# EAGLE design cociclo_03_01 (EAGLE 8.6.0)
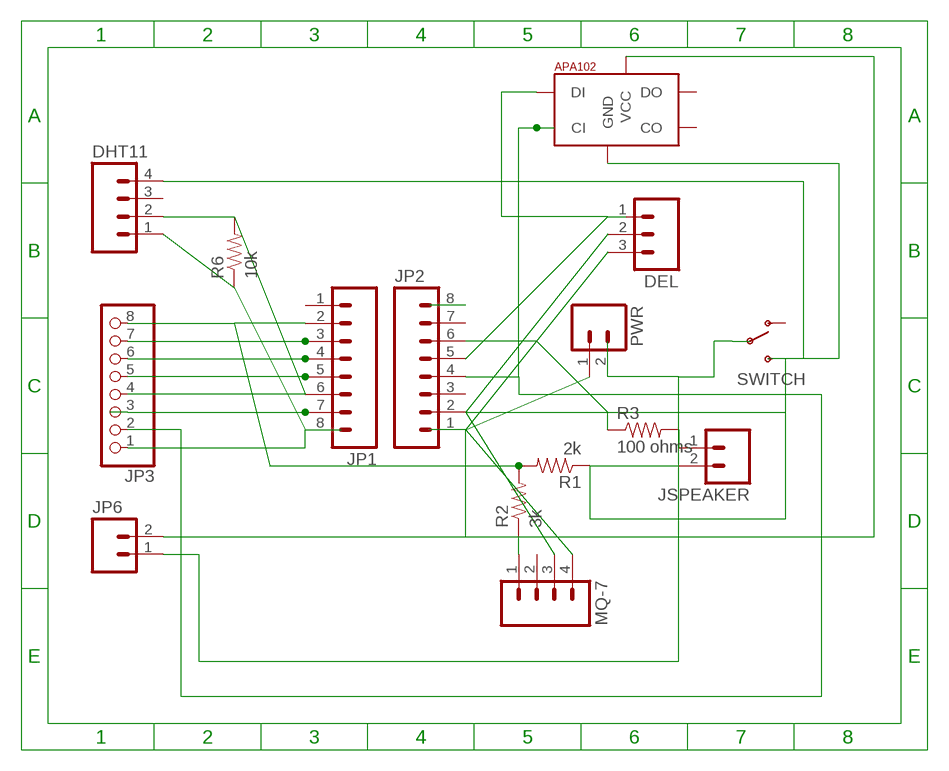
[diagram p0: schematic, sheet 1]

## Parts
DEL  M03PTH  [1X03]
DHT11  M04PTH  [1X04]
JP1  M08  [1X08_ROUND]
JP2  M08  [1X08_ROUND]
JP3  PINHD-1X8-3.5MM  [1X08-3.5MM]
JP6  M023.5MM  [SCREWTERMINAL-3.5MM-2]
JSPEAKER  M02PTH  [1X02]
LED  APA1025050  [APA102_5050]
MQ-7  M04PTH  [1X04]
PWR  M02LOCK_LONGPADS  [1X02_LOCK_LONGPADS]
R1  2k  RESISTOR1206  [1206]
R2  3k  RESISTOR1206  [1206]
R3  100 ohms  RESISTOR1206  [1206]
R6  10k  RESISTOR1206  [1206]
SWITCH  SWITCH-SPDTKIT  [SWITCH-SPDT_KIT]

## Nets
+5V: DEL.3 JP2.1 JP6.2 LED.1(VCC) MQ-7.4 PWR.1
ADC: JP1.2 JP3.8 R1.2 R2.2
CH_PD: DHT11.1 JP1.8 JP3.1 R6.1
D2: DEL.1 JP2.5 LED.4(DI)
GND: DEL.2 DHT11.4 JP2.2 JSPEAKER.2 LED.6(GND) MQ-7.3 R1.1 SWITCH.3(S)
GPIO12: JP2.6 R3.1
GPIO14: DHT11.2 JP1.6 JP3.4 R6.2
MQ7ANALOG: MQ-7.1 R2.1
N$4: JSPEAKER.1 R3.2
N$8: JP1.7 JP3.3
N$9: JP6.1 PWR.2 SWITCH.2(P)
N$10: JP2.4 JP3.2 LED.5(CI)
N$11: JP1.5 JP3.5
N$12: JP1.4 JP3.6
N$13: JP1.3 JP3.7
N$14: JP2.8
Unconnected: DHT11.3 JP1.1 JP2.3 JP2.7 LED.2(CO) LED.3(DO) MQ-7.2 SWITCH.1(O)

## Library data of the parts
DEL = SparkFun-Connectors:M03: Header 3 Standard 3-pin 0.1" header. Use with straight break away headers (SKU : PRT-00116), right angle break away headers (PRT-00553), swiss pins (PRT-00743), machine pins (PRT-00117), and female headers (PRT-00115). Molex polarized connector foot print use with SKU : PRT-08232 with associated crimp pins and housings.
DHT11 MQ-7 = SparkFun-Connectors:M04: Header 4 Standard 4-pin 0.1" header. Use with straight break away headers (SKU : PRT-00116), right angle break away headers (PRT-00553), swiss pins (PRT-00743), machine pins (PRT-00117), and female headers (PRT-00115). Molex polarized connector foot print use with SKU : PRT-08231 with associated crimp pins and housings. 1MM SMD Version SKU: PRT-10208
JP1 JP2 = SparkFun-Connectors:M08: Header 8 Standard 8-pin 0.1" header. Use with straight break away headers (SKU : PRT-00116), right angle break away headers (PRT-00553), swiss pins (PRT-00743), machine pins (PRT-00117), and female headers (PRT-00115).
JP3 = adafruit:PINHD-1X8: PIN HEADER
JP6 = SparkFun-Connectors:M02: Standard 2-pin 0.1" header. Use with - straight break away headers ( PRT-00116) - right angle break away headers (PRT-00553) - swiss pins (PRT-00743) - machine pins (PRT-00117) - female headers (PRT-00115) Molex polarized connector foot print use with: PRT-08233 with associated crimp pins and housings. 2.54_SCREWTERM for use with PRT-10571. 3.5mm Screw Terminal footprints for PRT-08084 5mm Screw Terminal footprints for use with PRT-08432; PROD_ID: CONN-08399
JSPEAKER PWR = SparkFun-Connectors:M02: Standard 2-pin 0.1" header. Use with - straight break away headers ( PRT-00116) - right angle break away headers (PRT-00553) - swiss pins (PRT-00743) - machine pins (PRT-00117) - female headers (PRT-00115) Molex polarized connector foot print use with: PRT-08233 with associated crimp pins and housings. 2.54_SCREWTERM for use with PRT-10571. 3.5mm Screw Terminal footprints for PRT-08084 5mm Screw Terminal footprints for use with PRT-08432
LED = jos-ph:APA102: APA102C 5050 RGB LED -- Adafruit DotStar Single LED Pixel Product Page: https://www.adafruit.com/products/2343 Datasheet: https://cdn-shop.adafruit.com/product-files/2343/APA102C.pdf
R1-R3 R6 = SparkFun-Resistors:RESISTOR: Resistor Basic schematic elements and footprints for 0603, 1206, and PTH resistors.
SWITCH = SparkFun-Electromechanical:SWITCH-SPDT: SPDT Switch Simple slide switch, Spark Fun Electronics SKU : COM-00102 DPDT SMT slide switch, AYZ0202, SWCH-08179; PROD_ID: SWCH-08261

## Board
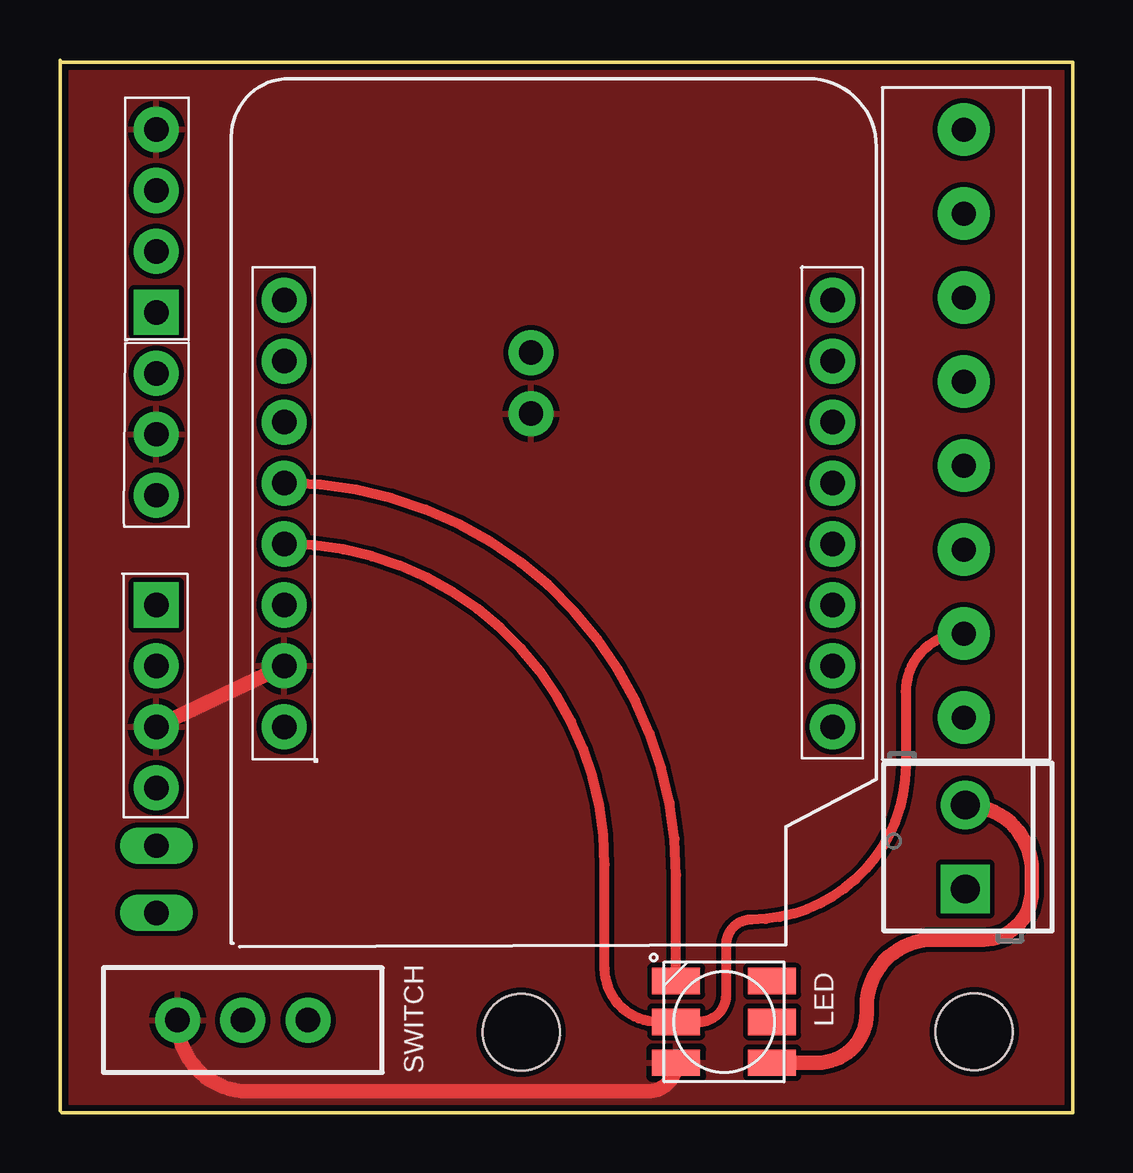
[diagram p1: board, top side]
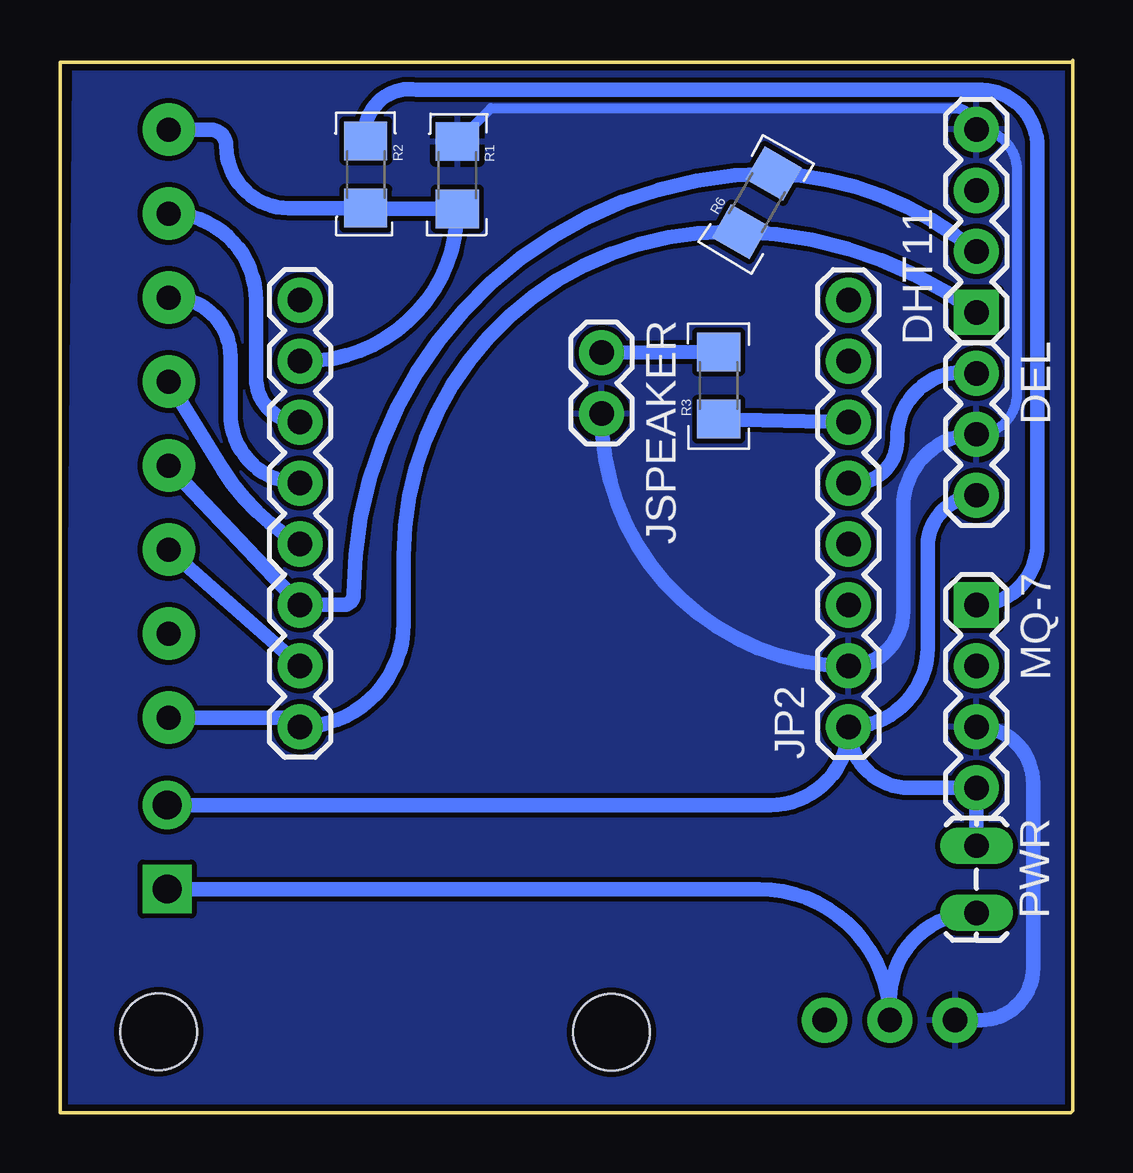
[diagram p2: board, bottom side, seen from below]

Size 42.21 x 43.87 mm. Coordinates in mm from the lower left corner, seen from the top.
Outline: 0,43.87 0,43.76
Outline: 0,43.76 0,0.08 0.08,0 42.21,0 42.21,43.76 0,43.76
Copper layers (1*16): Top 0.035mm / dielectric 1.5mm / Bottom 0.035mm
Design rules "adafruit *": minimum track width 10mil, minimum drill 15.5mil, track to track 8mil, track to pad 8mil, pad to pad 8mil, via to via 8mil, smd to smd 8mil, copper to edge 10mil, drill to drill 8mil, minimum pad ring 10mil, minimum via ring 8mil, stop-mask expansion 2mil, vias tented up to drill 20mil, thermal gap 10mil
Holes 3.2 mm at 38.11,3.38 19.23,3.35

### Footprints (pad centres in the part's own frame; a part is rotated, then mirrored left to right if it is on the bottom)
1X03 = drill 1.016 pad 1.88: 1 0,0; 2 2.54,0; 3 5.08,0
1X04 = drill 1.016 pad 1.88 square: 1 0,0 | drill 1.016 pad 1.88: 2 2.54,0; 3 5.08,0; 4 7.62,0
1X08_ROUND = drill 1.016 pad 1.88: 1 0,0; 2 2.54,0; 3 5.08,0; 4 7.62,0; 5 10.16,0; 6 12.7,0; 7 15.24,0; 8 17.78,0
1X08-3.5MM = drill 1 pad 2.184: 1 -12.25,0; 2 -8.75,0; 3 -5.25,0; 4 -1.75,0; 5 1.75,0; 6 5.25,0; 7 8.75,0; 8 12.25,0
SCREWTERMINAL-3.5MM-2 = drill 1.2 pad 2.032 square: 1 0,0 | drill 1.2 pad 2.032: 2 3.5,0
1X02 = drill 1.016 pad 1.88: 1 0,0; 2 2.54,0
APA102_5050 = smd 2 x 1.1: 1 2,-1.7; 2 2,0; 3 2,1.7; 4 -2,1.7; 5 -2,0; 6 -2,-1.7
1X02_LOCK_LONGPADS = drill 1.016 long: 1 -0.127,0; 2 2.667,0
1206 = smd 1.6 x 1.8: 1 -1.4,0; 2 1.4,0
SWITCH-SPDT_KIT = drill 1.016 pad 1.88: 1 0,2.718; 2 0,0; 3 0,-2.718

### Placement (x,y rotation side)
DEL  4.01,30.81 270 bottom
DHT11  4.01,33.35 90 bottom
JP1  32.21,33.86 270 bottom
JP2  9.35,16.08 90 bottom
JP3  37.68,28.72 90 top
JP6  37.74,9.32 90 top
JSPEAKER  19.63,31.67 270 bottom
LED  27.69,3.78 0 top
MQ-7  4.01,21.16 270 bottom
PWR  4.01,11 270 bottom
R1  25.65,39.07 270 bottom
R2  29.47,39.1 270 bottom
R3  14.76,30.3 90 bottom
R6  13.16,37.92 60 bottom
SWITCH  7.62,3.86 270 top

### Tracks (layer width: path | path; a pad name or v marks a point on that pad's centre or on a via)
+5V
  Top 0.61: JP6.2 arc-90 40.51,10.05 40.51,9.25 arc-90 38.48,7.21 36.4,7.21 arc90 33.63,4.45 33.63,4.14 arc-90 31.57,2.08 LED.1
  Bottom 0.61: PWR.1 MQ-7.4 6.81,13.54 arc90 JP2.1 | DEL.3 arc-90 6.04,23.44 6.04,19.38 arc90 JP2.1 | JP2.1 arc90 12.6,12.82 JP6.2
ADC
  Bottom 0.61: JP1.2 32,31.32 arc-90 R1.2 29.23,37.66 arc90 29.35,37.78 28.86,37.78 arc90 R2.2 32.69,37.7 arc90 35.28,40.28 arc-90 35.96,40.97 JP3.8
CH_PD
  Bottom 0.406: 14.37,36.71 R6.1
  Bottom 0.61: R6.1 arc35 DHT11.1 | 14.37,36.71 arc-90 27.89,23.19 27.89,20.4 arc90 JP1.8 arc-90 32.6,16.47 JP3.1
D2
  Top 0.406: LED.4 25.69,9.9 arc90 JP2.5
  Bottom 0.406: JP2.5 9.09,26.24
  Bottom 0.61: 9.09,26.24 arc-90 7.31,28.02 arc104 DEL.1
GND
  Top 0.61: JP2.2 9.37,18.62 MQ-7.3 | LED.6 arc-90 24.49,0.89 7.87,0.89 arc-90 SWITCH.3
  Bottom 0.406: DEL.2 arc-90 2.31,29.97 2.31,39.27 arc-90 DHT11.4 arc-90 4.9,41.86 24.26,41.86 R1.1
  Bottom 0.61: DEL.2 arc-90 7.06,25.22 7.06,20.9 | 7.06,20.9 arc90 JP2.2 9.37,18.62 arc90 JSPEAKER.2 | SWITCH.3 3.83,3.86 arc-90 1.65,6.04 1.65,13.72 arc-90 MQ-7.3 | 7.06,20.9 arc90 9.42,18.54 9.6,18.54
  pour Bottom: 0.4,0.04 0.33,43.57 41.64,43.41 42,0.27
  pour Top: 0.4,0.3 0.33,43.58 42.18,43.49 41.84,0.17
GPIO12
  Bottom 0.61: JP2.6 R3.1
GPIO14
  Bottom 0.61: DHT11.2 arc-37 R6.2 arc-90 29.97,21.62 29.97,21.59 arc90 30.4,21.16 JP1.6 JP3.4
MQ7ANALOG
  Bottom 0.61: MQ-7.1 arc-90 1.47,23.7 1.47,40.21 arc-90 3.79,42.62 27.35,42.63 arc-103 29.49,40.69 arc-134 R2.1
N$4
  Bottom 0.61: JSPEAKER.1 R3.2
N$8
  Bottom 0.61: JP3.3 JP1.7
N$9
  Bottom 0.61: PWR.2 arc-90 7.62,4.72 SWITCH.2 arc-90 13.08,9.32 JP6.1
N$10
  Top 0.406: JP2.4 arc-90 22.71,10.34 22.71,6.02 arc90 24.94,3.79 LED.5 26.64,3.79 arc90 27.76,4.9 27.76,6.99 arc-90 28.83,8.05 arc90 35.25,14.48 35.25,17.54 arc-90 JP3.2
N$11
  Bottom 0.61: JP3.5 35.43,26.82 arc-29 JP1.5
N$12
  Bottom 0.61: JP3.6 37.57,33.97 arc90 35.1,31.5 35.1,29.13 arc-90 JP1.4
N$13
  Bottom 0.61: JP3.7 arc90 34.04,33.83 34.04,30.61 arc-90 JP1.3

### Text on the board
uqam: v0.3
noms_b: G | A0 | 10k | 2k | 3k | D0 | D7 | 3V | RST | D5 | DHT11 | A0 | D2 | D6 | D1 | D0 | G | D2 | 0.1k | SPK | D5 | D7 | DEL | V+ | D3 | D6 | D8 | D7 | A0 | D3 | G | D8 | G | V+ | 3V3 | 3V | MQ-7 | V+ | 5V | V+ | G | G | PWR
192bmp: /Users/uqam/Desktop/ohanda_logo.bmp
noms_t: G | DHT11 | D7 | 3V | A0 | D2 | D1 | SPKR | G | V+ | D2 | DEL | D3 | D7 | A0 | G | G | 3V3 | V+ | V+ | MQ-7 | V+ | V+ | G | G | PWR
200bmp: /Users/uqam/Desktop/Artengine_logo_petit_n_b.bmp | /Users/uqam/Desktop/cociclo_logo.bmp